# EAGLE design Shield_ver2 (EAGLE 9.5.2)
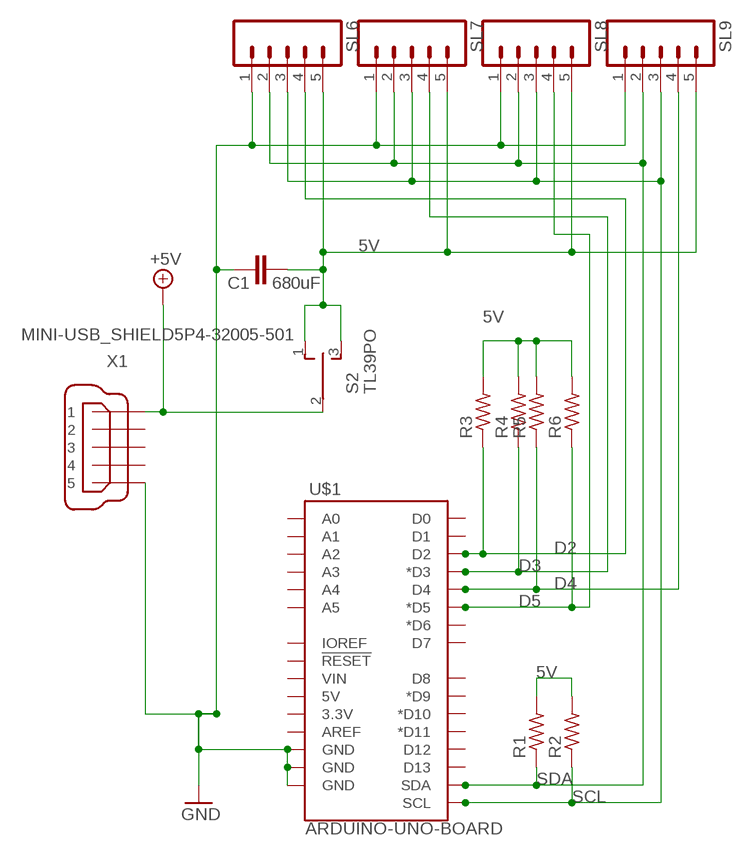
[diagram p0: schematic, sheet 1]

## Parts
C1  680uF  C5/2.5  [C5B2.5]
R1  R-US_R0805  [R0805]
R2  R-US_R0805  [R0805]
R3  R-US_R0805  [R0805]
R4  R-US_R0805  [R0805]
R5  R-US_R0805  [R0805]
R6  R-US_R0805  [R0805]
S2  TL39PO  [TL3XPO]
SL6  M05  [05P]
SL7  M05  [05P]
SL8  M05  [05P]
SL9  M05  [05P]
U$1  ARDUINO-UNO-BOARD  [ARDUINO-UNO-BOARD]
X1  MINI-USB_SHIELD5P4-32005-501  [32005-501]

## Nets
5V: C1.2 R1.2 R2.2 R3.2 R4.2 R5.2 R6.2 S2.1(O) S2.3(S) SL6.5 SL7.5 SL8.5 SL9.5
+5V: S2.2(P) X1.1
D2: R3.1 SL6.4 U$1.D2
D3: R4.1 SL7.4 U$1.D3(*D3)
D4: R5.1 SL9.4 U$1.D4
D5: R6.1 SL8.4 U$1.D5(*D5)
GND: C1.1 SL6.1 SL7.1 SL8.1 SL9.1 U$1.GND@1(GND) U$1.GND@2(GND) U$1.GND@3(GND) X1.5
SCL: R2.1 SL6.3 SL7.3 SL8.3 SL9.3 U$1.SCL
SDA: R1.1 SL6.2 SL7.2 SL8.2 SL9.2 U$1.SDA
Unconnected: U$1.3.3V U$1.5V U$1.A0 U$1.A1 U$1.A2 U$1.A3 U$1.A4 U$1.A5 U$1.AREF U$1.D0 U$1.D1 U$1.D6(*D6) U$1.D7 U$1.D8 U$1.D9(*D9) U$1.D10(*D10) U$1.D11(*D11) U$1.D12 U$1.D13 U$1.IOREF U$1.RESET@1(!RESET!) U$1.VIN X1.2 X1.3 X1.4 X1.M1(S1) X1.M2(S2) X1.M3(S3) X1.M4(S4)

## Library data of the parts
C1 = capacitor-wima:C: CAPACITOR naming: grid - package width
R1-R6 = rcl:R-US_: RESISTOR, American symbol; SPICEPREFIX: R
S2 = switch:TL39PO: TINY SWITCH ON OFF ON Source: http://www2.produktinfo.conrad.com/datenblaetter/700000-724999/705152-da-01-de-Subminiaturschalter_TL_36YO.pdf
SL6-SL9 = con-amp-quick:M05: AMP QUICK CONNECTOR; OC_FARNELL: unknown; OC_NEWARK: unknown
U$1 = Shield_try2_usbA power:ARDUINO-UNO-BOARD: ARDUINO UNO BOARD
X1 = con-cypressindustries:MINI-USB_SHIELD5P4-: MINI USB-B R/A W/O POST 5 pol. Source: www.cypressindustries.com; OC_FARNELL: unknown; OC_NEWARK: unknown

## Board
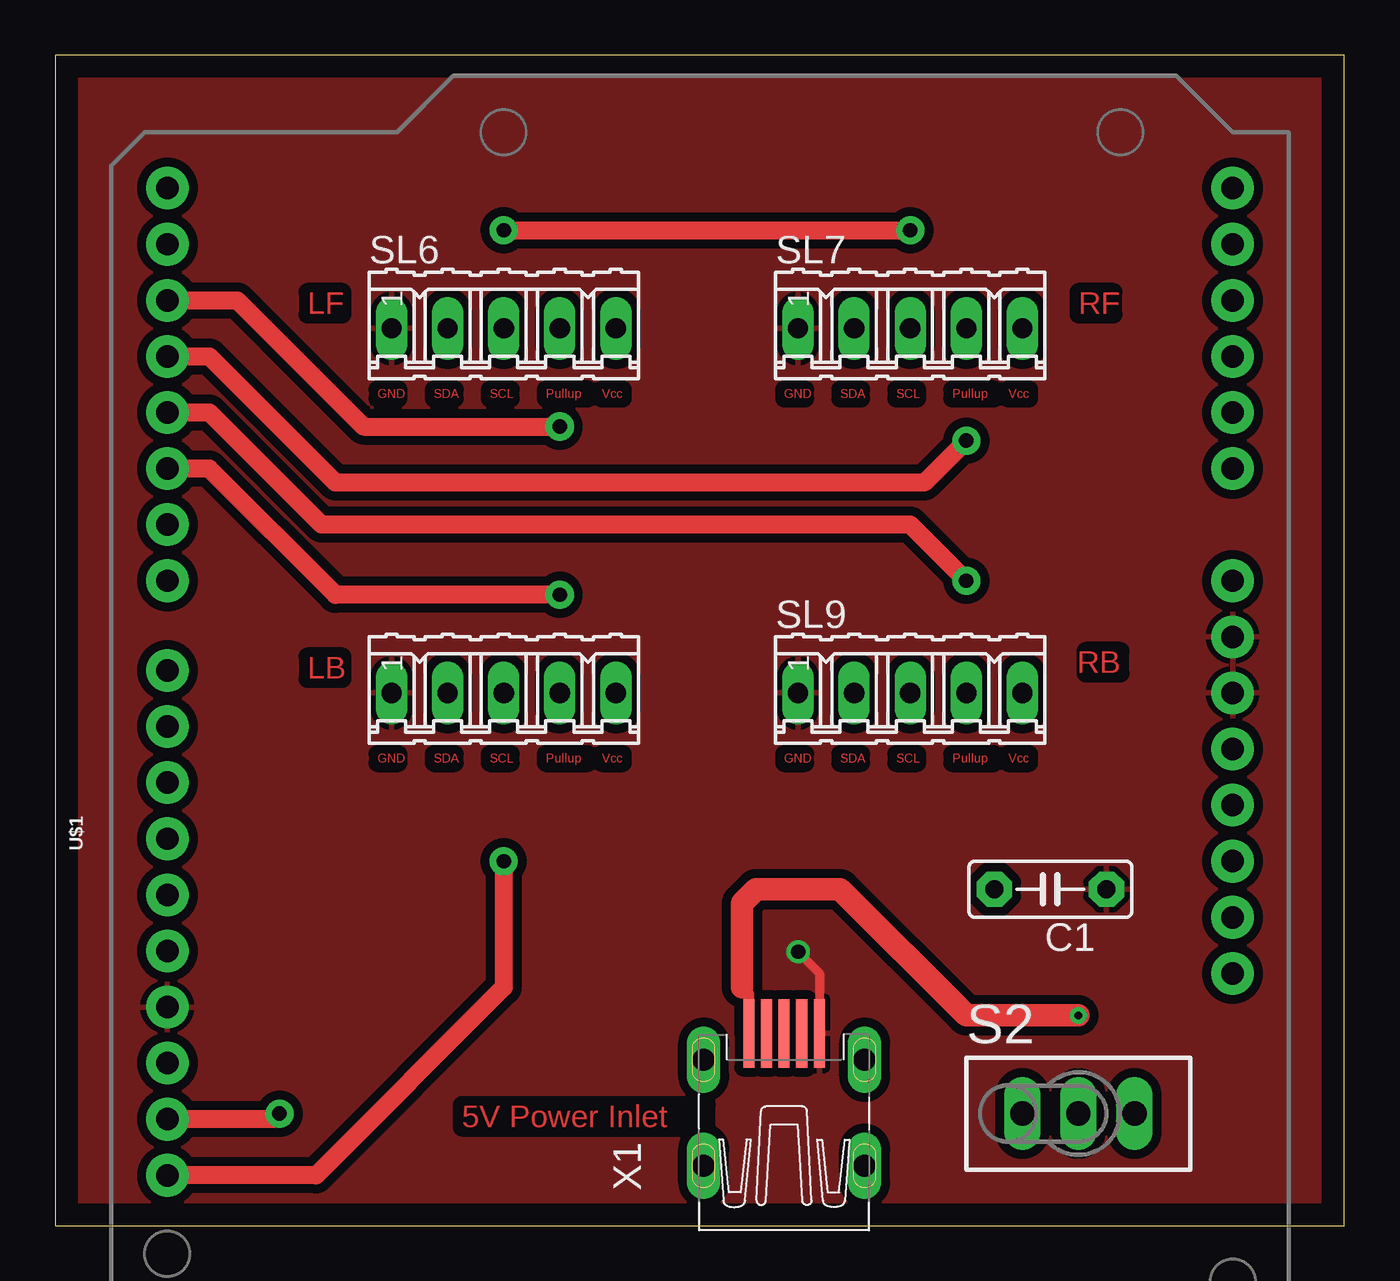
[diagram p1: board, top side]
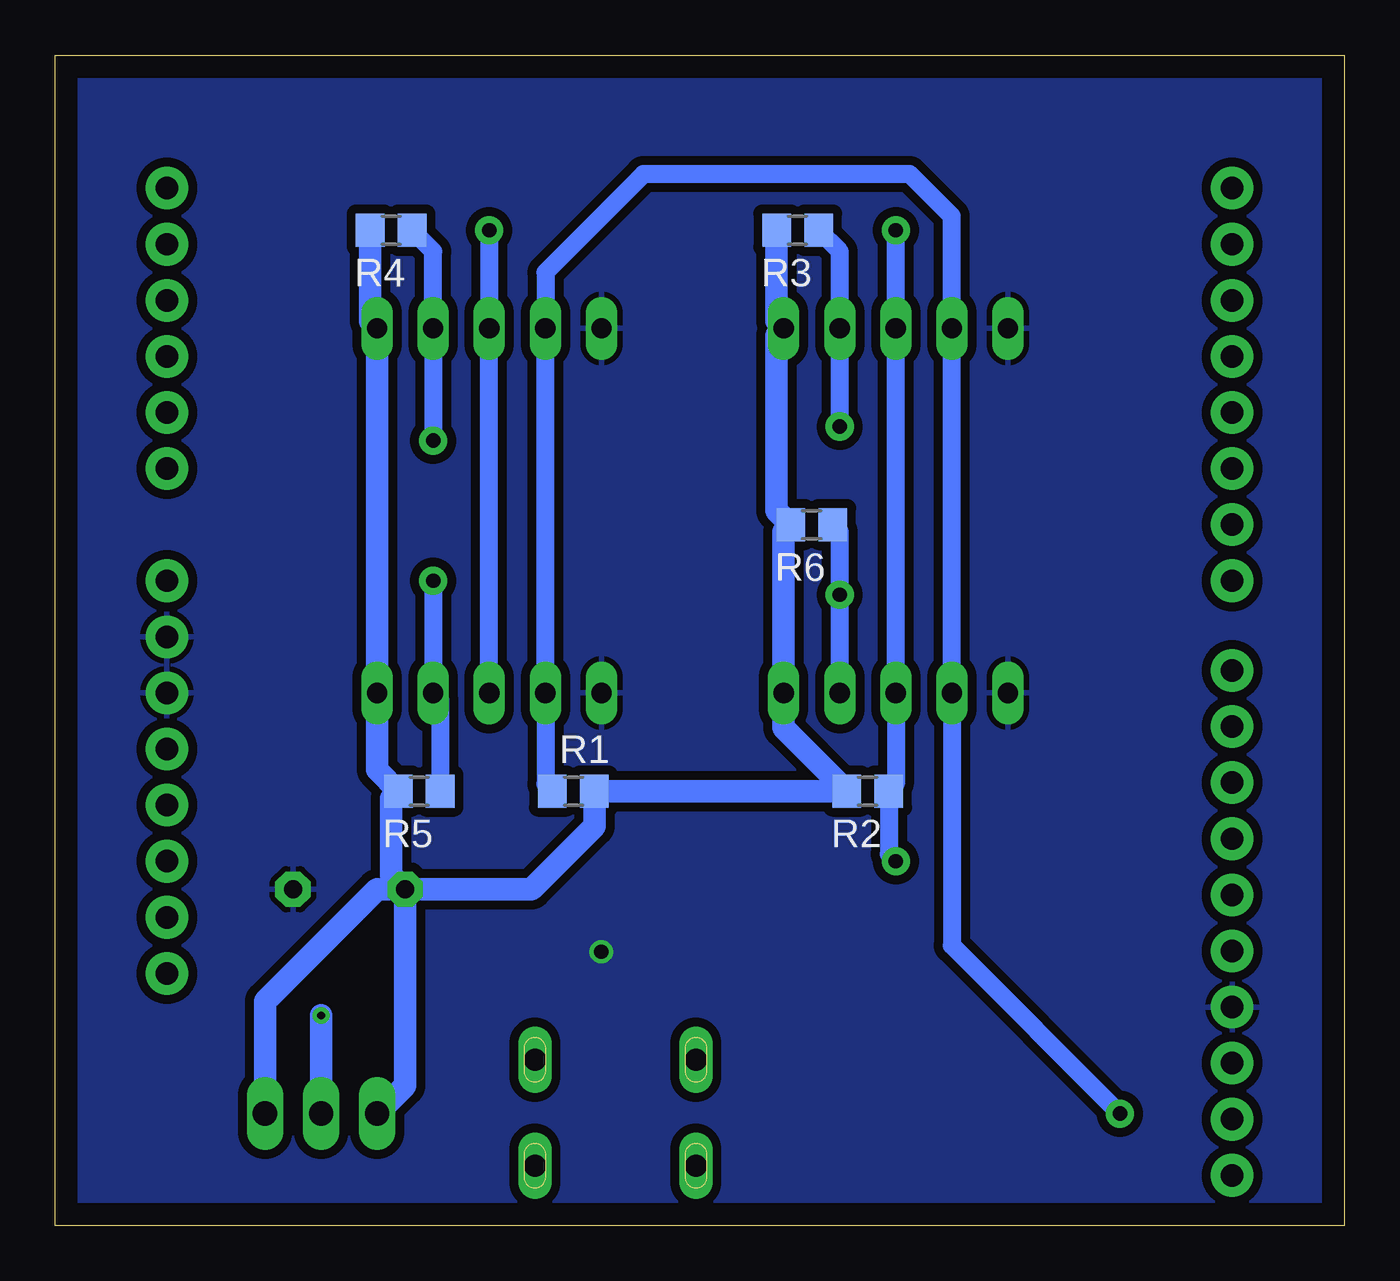
[diagram p2: board, bottom side, seen from below]

Size 58.4 x 53.01 mm. Coordinates in mm from the lower left corner, seen from the top.
Outline: 0,0 58.4,0 58.4,53.01 0,53.01 0,0
Copper layers (1*16): Top 0.035mm / dielectric 1.5mm / Bottom 0.035mm
Design rules "default *": minimum track width 6mil, minimum drill 0.35mm, track to track 16mil, track to pad 16mil, pad to pad 16mil, via to via 16mil, smd to smd 6mil, copper to edge 40mil, drill to drill 6mil, minimum pad ring 10mil, minimum via ring 8mil, stop-mask expansion 4mil, vias tented up to drill 0mil, thermal gap 10mil

### Footprints (pad centres in the part's own frame; a part is rotated, then mirrored left to right if it is on the bottom)
C5B2.5 = drill 0.813 pad 1.6 octagon: 1 -2.54,0; 2 2.54,0
R0805 = smd 1.3 x 1.5: 1 -0.95,0; 2 0.95,0
TL3XPO = drill 1.1 pad 1.422 long: 1 -2.54,0; 2 0,0; 3 2.54,0
05P = drill 0.914 long: 1 -5.08,0; 2 -2.54,0; 3 0,0; 4 2.54,0; 5 5.08,0
ARDUINO-UNO-BOARD = drill 1.016 pad 1.93: 3.3V 5.08,-24.13; 5V 7.62,-24.13; A0 20.32,-24.13; A1 22.86,-24.13; A2 25.4,-24.13; A3 27.94,-24.13; A4 30.48,-24.13; A5 33.02,-24.13; AREF -6.604,24.13; D0 33.02,24.13; D1 30.48,24.13; D2 27.94,24.13; D3 25.4,24.13; D4 22.86,24.13; D5 20.32,24.13; D6 17.78,24.13; D7 15.24,24.13; D8 11.176,24.13; D9 8.636,24.13; D10 6.096,24.13; D11 3.556,24.13; D12 1.016,24.13; D13 -1.524,24.13; GND@1 10.16,-24.13; GND@2 12.7,-24.13; GND@3 -4.064,24.13; IOREF 0,-24.13; NC -2.54,-24.13; RESET@1 2.54,-24.13; SCL -11.684,24.13; SDA -9.144,24.13; VIN 15.24,-24.13
32005-501 = smd 3.1 x 0.5: 1 3,1.6; 2 3,0.8; 3 3,0; 4 3,-0.8; 5 3,-1.6 | drill 1 pad 1.422 long: M1 -3,3.65; M2 -3,-3.65; M3 1.8,3.65; M4 1.8,-3.65

### Placement (x,y rotation side)
C1  45.09,15.24 180 top
R1  34.92,19.69 0 bottom
R2  21.59,19.69 180 bottom
R3  24.77,45.09 180 bottom
R4  43.18,45.09 180 bottom
R5  41.91,19.69 180 bottom
R6  24.13,31.75 180 bottom
S2  46.35,5.08 0 top
SL6  20.32,40.64 0 top
SL7  38.73,40.64 0 top
SL8  20.32,24.13 0 top
SL9  38.73,24.13 0 top
U$1  29.21,13.97 90 top
X1  33.02,5.72 90 top

### Tracks (layer width: path | path; a pad name or v marks a point on that pad's centre or on a via)
5V
  Bottom 1.016: C1.2 43.18,15.88 43.18,19.37 R5.2 43.81,20.64 SL9.5 SL7.5 44.13,40.95 R4.2 | R3.2 25.71,40.95 SL6.5 25.71,40.33 25.71,32.39 R6.2 25.4,31.43 SL8.5 25.4,22.55 R2.2 R1.2 33.97,18.09 36.83,15.24 C1.2 | S2.1 42.54,6.35 C1.2 | S2.3 48.89,10.16 43.81,15.24 C1.2
+5V  (via drill 0.35)
  Top 0.508: X1.1 31.42,10.49 31.11,10.79
  Top 1.016: v46.35,9.53 41.27,9.53 35.56,15.24 31.75,15.24 31.11,14.61 31.11,10.79
  Bottom 1.016: S2.2 v46.35,9.53
D2  (via drill 0.65 pad 1.27)
  Top 0.813: U$1.D2 8.25,41.91 13.97,36.2 v22.86,36.2
  Bottom 0.813: v22.86,36.2 SL6.4 22.86,44.13 R3.1
D3  (via drill 0.65 pad 1.27)
  Top 0.813: U$1.D3 6.98,39.37 12.7,33.66 39.37,33.66 v41.27,35.56
  Bottom 0.813: v41.27,35.56 SL7.4 41.27,44.13 R4.1
D4  (via drill 0.65 pad 1.27)
  Top 0.813: U$1.D4 6.98,36.83 12.06,31.75 38.73,31.75 v41.27,29.21
  Bottom 0.813: v41.27,29.21 SL9.4 40.96,23.82 R5.1
D5  (via drill 0.65 pad 1.27)
  Top 0.813: v22.86,28.57 12.7,28.57 6.98,34.29 U$1.D5
  Bottom 0.813: SL8.4 v22.86,28.57 22.86,31.43 R6.1
GND  (via drill 0.65)
  Top 0.406: v33.66,12.41 34.62,11.44 X1.5
  Bottom 0.813: 33.6,12.41 v33.66,12.41
  pour Top: -0.64,53.34 59.05,53.34 59.05,-0.63 -0.64,-0.63
  pour Bottom: -1.27,53.98 59.69,53.98 59.69,-1.27 -1.27,-1.27
SCL  (via drill 0.65 pad 1.27)
  Top 0.813: v20.32,16.51 20.32,10.79 11.81,2.29 U$1.SCL | v20.32,45.09 v38.73,45.09
  Bottom 0.813: v20.32,16.51 20.64,16.83 R2.1 20.32,20.01 SL8.3 SL6.3 v20.32,45.09 | SL9.3 SL7.3 v38.73,45.09
SDA  (via drill 0.65 pad 1.27)
  Top 0.813: v10.16,5.08 9.91,4.83 U$1.SDA
  Bottom 0.813: v10.16,5.08 17.78,12.7 SL8.2 SL6.2 17.78,45.72 19.69,47.62 31.75,47.62 36.2,43.18 SL7.2 SL9.2 36.2,20.01 R1.1

### Text on the board
Top: LF | RF | GND | SDA | SCL | Pullup | Vcc | GND | SDA | SCL | Pullup | Vcc | RB | LB | GND | SDA | SCL | Pullup | Vcc | GND | SDA | SCL | Pullup | Vcc | 5V Power Inlet